# EasyEDA schematic Schematic_TurtleAuth - Stm32GPG_2022-05-26.json
TITLE: Board; REV: 1.0; Date: 2020-05-16; Sheet: 1/1; Drawn By: TheStaticTurtle
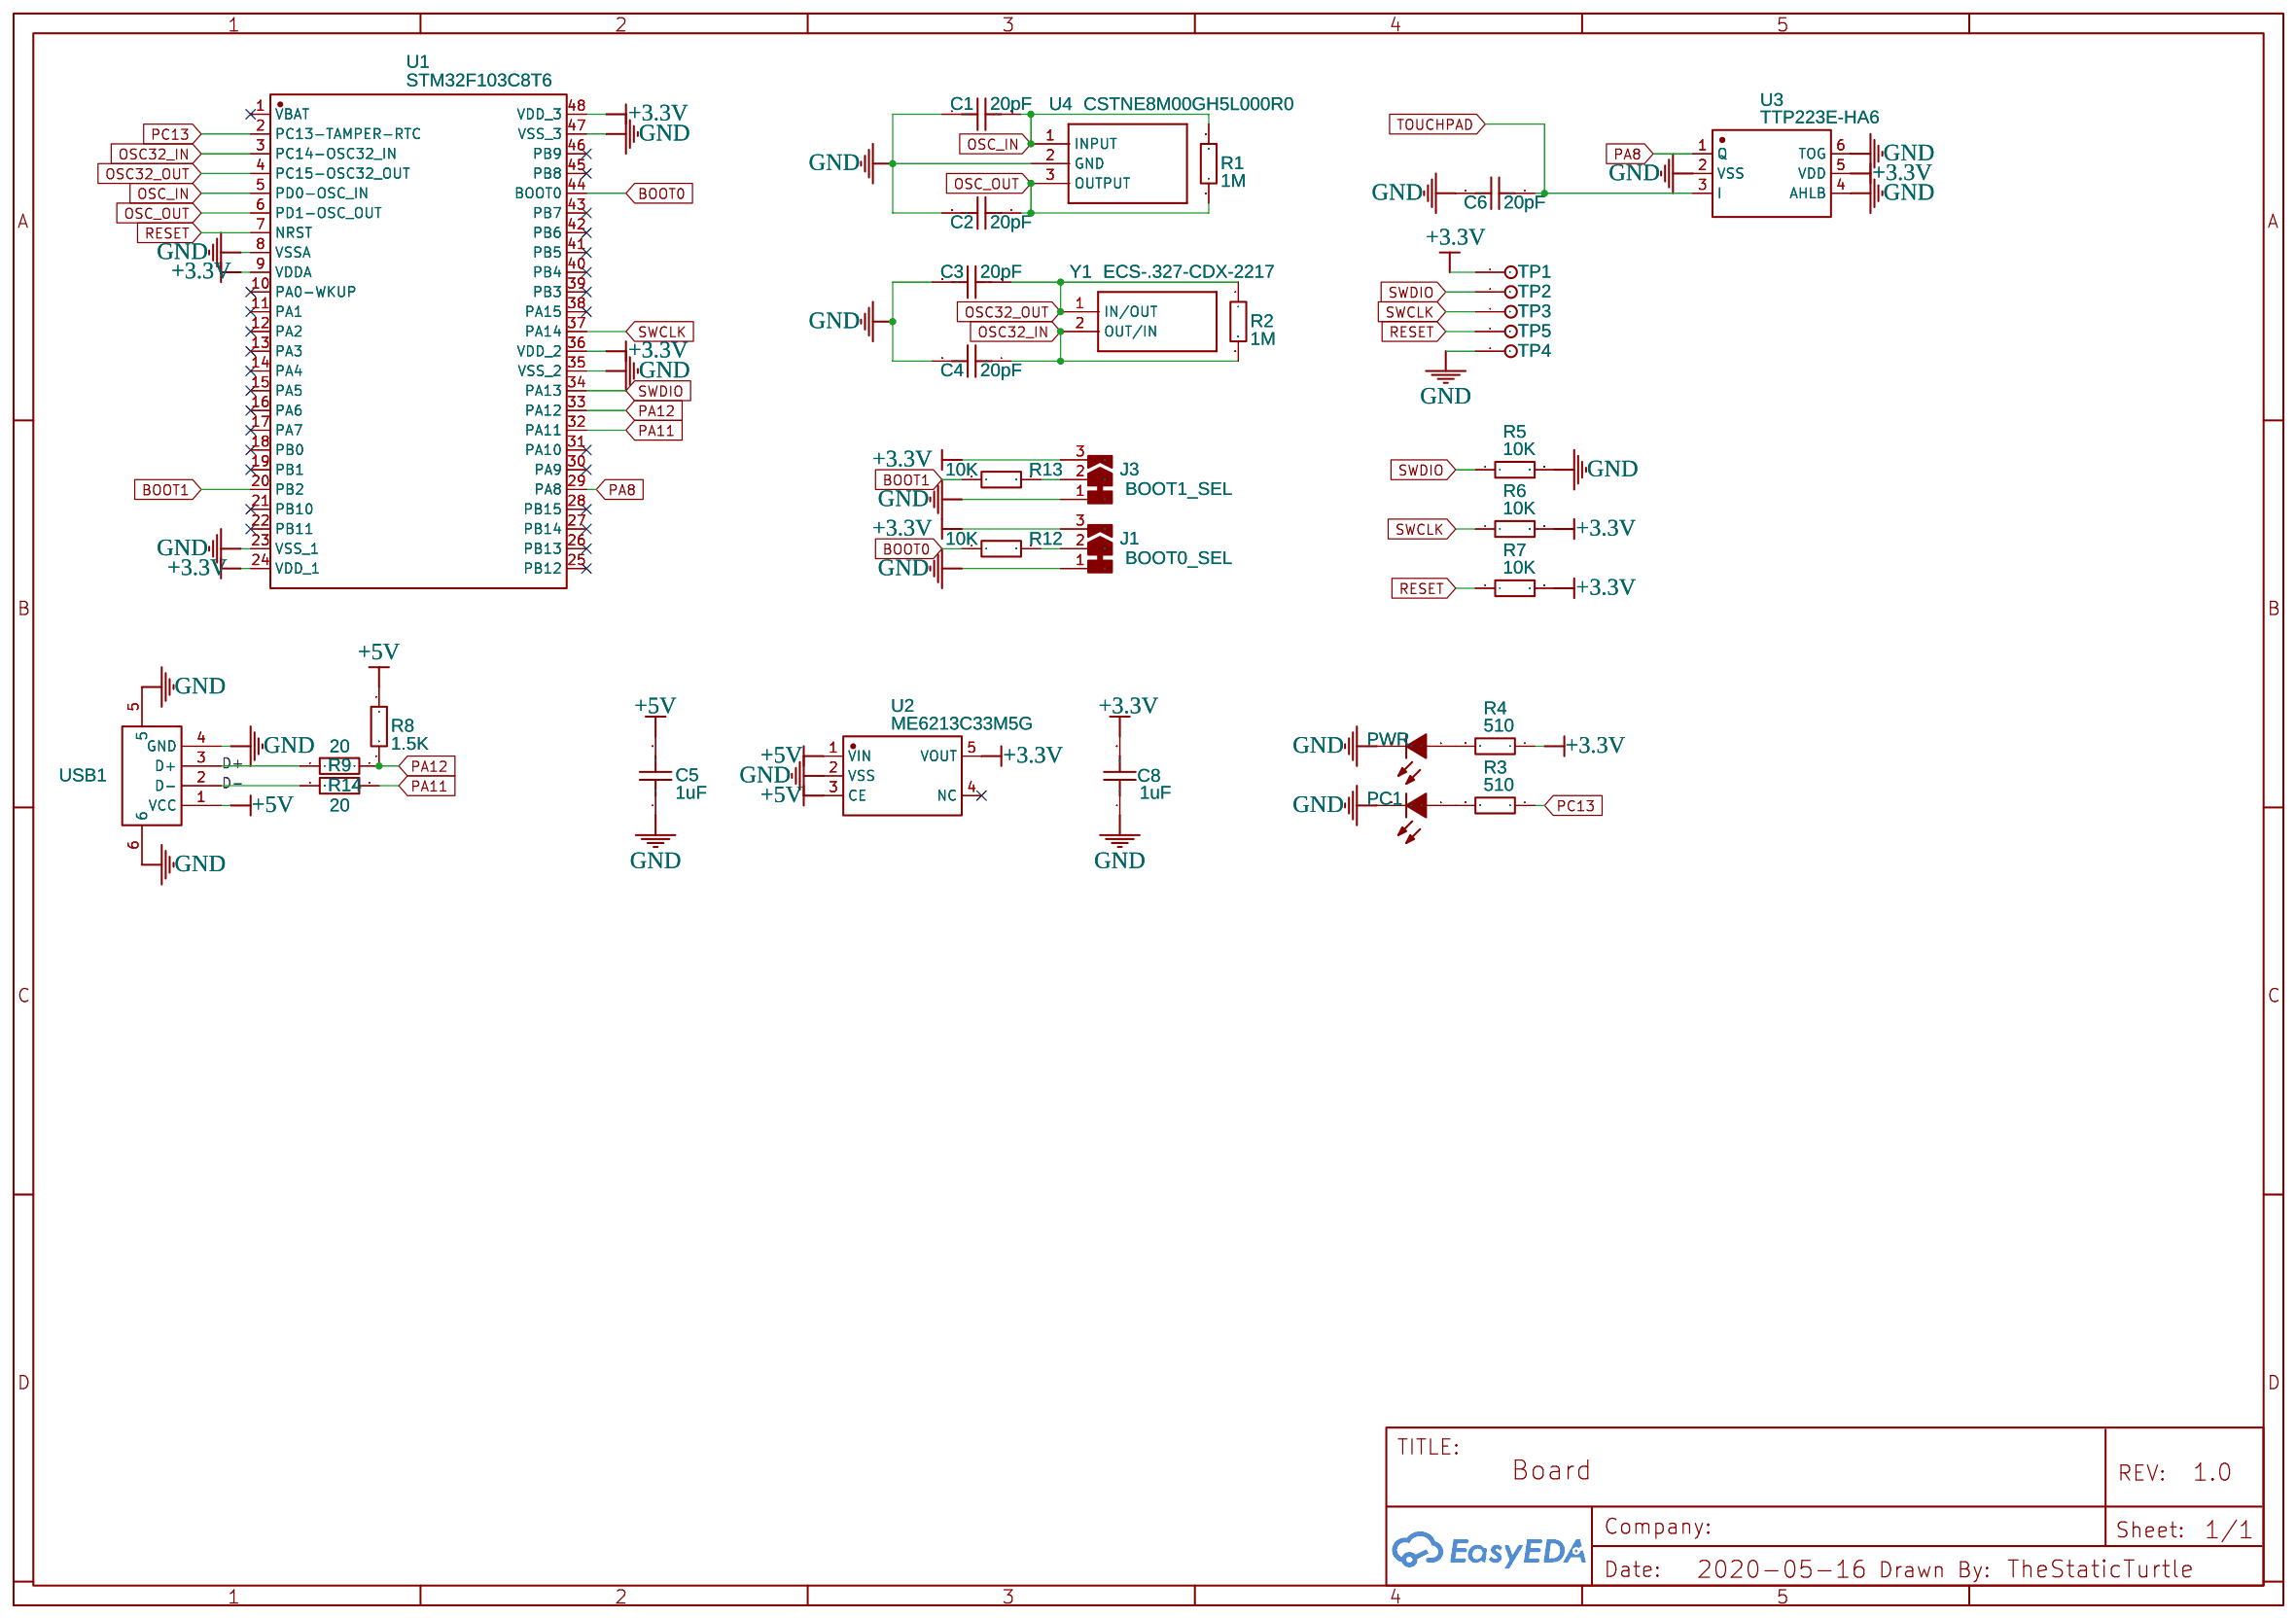
[diagram p0: schematic sheet]

## Parts
C1  20pF  [C0402]
C2  20pF  [C0402]
C3  20pF  [C0402]
C4  20pF  [C0402]
C5  1uF  [C0402]
C6  20pF  [C0402]
C8  1uF  [C0402]
J1  BOOT0_SEL  [JMP-2WAY-SELECTOR-NC-NO]
J3  BOOT1_SEL  [JMP-2WAY-SELECTOR-NC-NO]
PC1  FC-D1608HOK-600H  [LED0603-FD]
PWR  FC-D1608HOK-600H  [LED0603-FD]
R1  1M  [R0402]
R2  1M  [R0402]
R3  510  [R0402]
R4  510  [R0402]
R5  10K  [R0402]
R6  10K  [R0402]
R7  10K  [R0402]
R8  1.5K  [R0402]
R9  20  [R0402]
R12  10K  [R0402]
R13  10K  [R0402]
R14  20  [R0402]
TP1  Test Point  [TESTPOINT]
TP2  Test Point  [TESTPOINT]
TP3  Test Point  [TESTPOINT]
TP4  Test Point  [TESTPOINT]
TP5  Test Point  [TESTPOINT]
U1  STM32F103C8T6  [LQFP-48_L7.0-W7.0-P0.50-LS9.0-BL]
U2  ME6213C33M5G  [SOT-23-5_L3.0-W1.7-P0.95-LS2.8-BL]
U3  TTP223E-HA6  [SOT-23-6_L2.9-W1.6-P0.95-LS2.8-BL]
U4  CSTNE8M00GH5L000R0  [CSTNE16M0V530000R0]
USB1  U217-04XN-XXR84  [USB-A-SMD_U217-041N-4BV81]
Y1  ECS-.327-CDX-2217  [ECS327CDX2217]

## Library data of the parts
C1-C4 C6 = 0603N200J500: Supplier: Mouser; Supplier Part: 81-GJM0225C1C200JB1L; Manufacturer: Murata Electronics; Manufacturer Part: GJM0225C1C200JB01L; Contributor: LCSC
C5 C8 = 0603F105Z160: Supplier: Mouser; Supplier Part: 963-JMK105BJ105KV8F; Manufacturer: Taiyo Yuden; Manufacturer Part: JMK105BJ105KV8F; Contributor: LCSC
J1 J3 = 2-way SMD Arrow Selector (NC/NO): Contributor: irukard
PC1 = FC-D1608HOK-600H: Supplier: Mouser; Manufacturer: Lite-On; Manufacturer Part: LTST-C194TBKT; Supplier Part: 859-LTST-C194TBKT
PWR = FC-D1608HOK-600H: Supplier: Mouser; Manufacturer: Wurth Elektronik; Manufacturer Part: 150060RS75000; Supplier Part: 710-150060RS75000; LCSC Assembly: Yes; SMT Type: Extend
R1 R2 = 0603WAJ0105T5E: Supplier: Mouser; Manufacturer: KOA Speer; Manufacturer Part: RK73B1ETTP105J; Supplier Part: 660-RK73B1ETTP105J
R3 R4 = 0603WAJ0511T5E: Supplier: Mouser; Manufacturer: YAGEO; Manufacturer Part: RC0402JR-13510RL; Supplier Part: 603-RC0402JR-13510RL
R5-R7 R12 R13 = 0603WAJ0103T5E: Manufacturer: YAGEO; Manufacturer Part: RC0402FR-1310KL; Supplier Part: 603-RC0402FR-1310KL
R8 = 0603WAJ0152T5E: Supplier: Mouser; Manufacturer: YAGEO; Manufacturer Part: RE0402DRE071K5L; Supplier Part: 603-RE0402DRE071K5L
R9 R14 = RTT03200JTP: Supplier: Mouser; Manufacturer: TAGEO; Manufacturer Part: RC0402FR-7W20RL; Supplier Part: 603-RC0402FR-7W20RL
TP1-TP5 = Test Point: Contributor: sterlinggtake
U1 = STM32F103C8T6: Supplier: LCSC; Manufacturer: STMicroelectronics; LCSC Assembly: Yes; image: //image.lceda.cn/szlcsc/C8734.jpg; Supplier Part: C8734; SMT Type: Basic
U2 = ME6213C33M5G: Supplier: LCSC; Supplier Part: C236666; Manufacturer: Nanjing Micro One Elec; Contributor: LCSC; LCSC Assembly: Yes; SMT Type: Extend
U3 = TTP223E-HA6: Supplier: LCSC; Manufacturer: TONTEK; Contributor: LCSC; Supplier Part: C129459; LCSC Assembly: Yes; SMT Type: Extend
U4 = CSTNE8M00GH5L000R0: Contributor: TurtleForGaming; Supplier Part: 81-CSTNE8M00GH5L000R; Supplier: Mouser; Manufacturer: Murata Electronics
USB1 = U217-04XN-XXR84: Supplier: Mouser; Supplier Part: 640-USB1061-GF-L-A; Manufacturer: GCT; Manufacturer Part: USB1061-GF-L-A; Contributor: LCSC
Y1 = ECS-.327-CDX-2217: Contributor: TurtleForGaming; Manufacturer Part: 520-ECS-327-CDX2217; Manufacturer: ECS; Supplier Part: 520-ECS-327-CDX2217; Supplier: Mouser

## Nets
+3.3V: C8.2 J1.3 J3.3 R4.1 R6.2 R7.2 TP1.1 U1.9(VDDA) U1.24(VDD_1) U1.36(VDD_2) U1.48(VDD_3) U2.5(VOUT) U3.5(VDD)
+5V: C5.2 R8.1 U2.1(VIN) U2.3(CE) USB1.1(VCC)
GND: C1.1 C2.2 C3.2 C4.2 C5.1 C6.2 C8.1 J1.1 J3.1 PC1.2(K) PWR.2(K) R5.2 TP4.1 U1.8(VSSA) U1.23(VSS_1) U1.35(VSS_2) U1.47(VSS_3) U2.2(VSS) U3.2(VSS) U3.4(AHLB) U3.6(TOG) U4.2(GND) USB1.4(GND) USB1.5 USB1.6
BOOT0: R12.1 U1.44(BOOT0)
BOOT1: R13.1 U1.20(PB2)
D+: R9.1 USB1.3(D+)
D-: R14.1 USB1.2(D-)
OSC32_IN: C4.1 R2.2 U1.3(PC14-OSC32_IN) Y1.2(OUT/IN)
OSC32_OUT: C3.1 R2.1 U1.4(PC15-OSC32_OUT) Y1.1(IN/OUT)
OSC_IN: C1.2 R1.1 U1.5(PD0-OSC_IN) U4.1(INPUT)
OSC_OUT: C2.1 R1.2 U1.6(PD1-OSC_OUT) U4.3(OUTPUT)
PA8: U1.29(PA8) U3.1(Q)
PA11: R14.2 U1.32(PA11)
PA12: R8.2 R9.2 U1.33(PA12)
PC13: R3.1 U1.2(PC13-TAMPER-RTC)
RESET: R7.1 TP5.1 U1.7(NRST)
SWCLK: R6.1 TP3.1 U1.37(PA14)
SWDIO: R5.1 TP2.1 U1.34(PA13)
TOUCHPAD: C6.1 U3.3(I)
Net-(J1-2): J1.2 R12.2
Net-(J3-2): J3.2 R13.2
Net-(PC1-1): PC1.1(A) R3.2
Net-(PWR-1): PWR.1(A) R4.2

Not connected (* = marked no-connect by the designer): U1 1(VBAT)* 10(PA0-WKUP)* 11(PA1)* 12(PA2)* 13(PA3)* 14(PA4)* 15(PA5)* 16(PA6)* 17(PA7)* 18(PB0)* 19(PB1)* 21(PB10)* 22(PB11)* 25(PB12)* 26(PB13)* 27(PB14)* 28(PB15)* 30(PA9)* 31(PA10)* 38(PA15)* 39(PB3)* 40(PB4)* 41(PB5)* 42(PB6)* 43(PB7)* 45(PB8)* 46(PB9)*; U2 4(NC)*
